# EAGLE design Mirror Image Board (EAGLE 9.2.0)
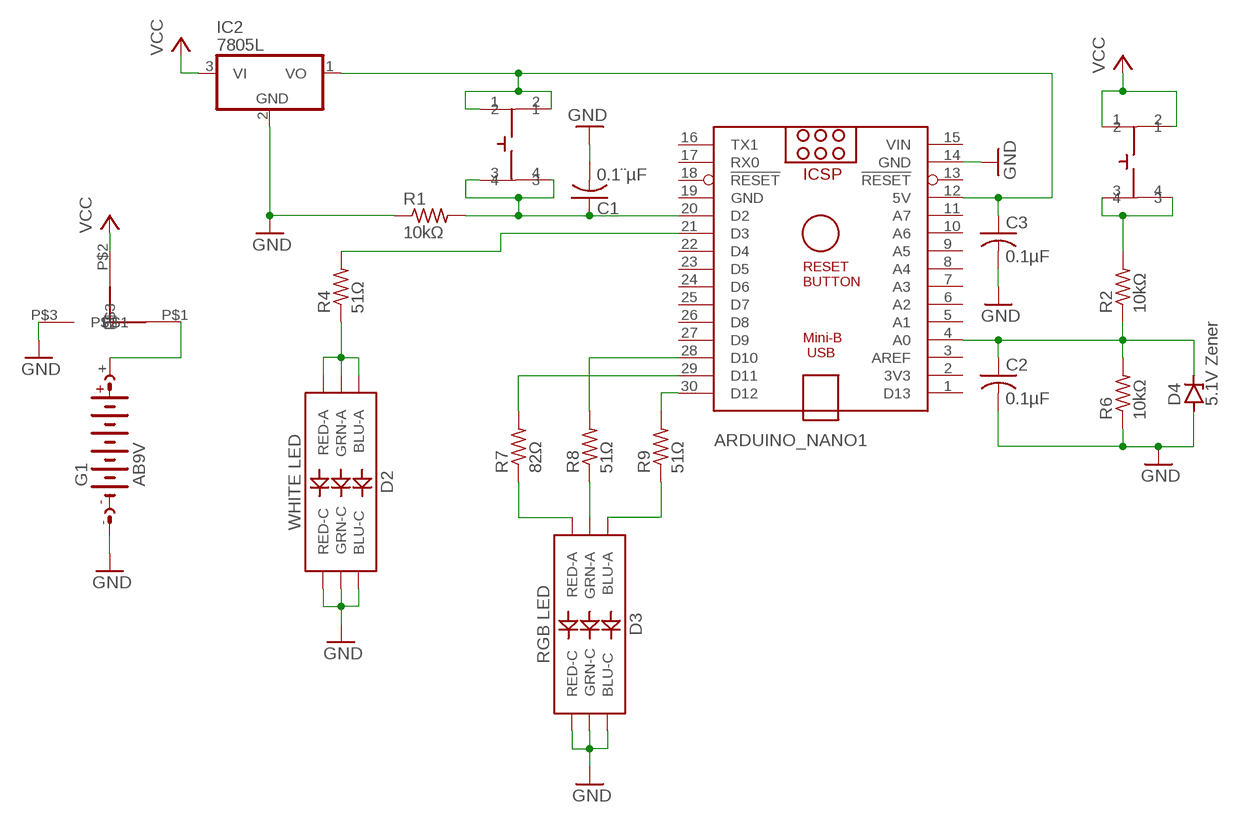
[diagram p0: schematic, sheet 1]

## Parts
ARDUINO_NANO1  ARDUINO_NANO  [ARDUINO_NANO]
C1  0.1¨µF  C-USC0805  [C0805]
C2  0.1µF  C-USC0805  [C0805]
C3  0.1µF  C-USC0805  [C0805]
D2  WHITE LED  LED-RGBNO_IC  [LED-TRICOLOR-5050]
D3  RGB LED  LED-RGBNO_IC  [LED-TRICOLOR-5050]
D4  5.1V Zener  ZENER-DIODESOD64-12  [SOD64Z12]
G1  AB9V  [AB9V]
IC2  7805L  [TO92]
R1  10kΩ  R-US_R0805  [R0805]
R2  10kΩ  R-US_R0805  [R0805]
R4  51Ω  R-US_R0805  [R0805]
R6  10kΩ  R-US_R0805  [R0805]
R7  82Ω  R-US_R0805  [R0805]
R8  51Ω  R-US_R0805  [R0805]
R9  51Ω  R-US_R0805  [R0805]
U$1  SKRPABE010  [SKRPABE010]
U$2  SKRPABE010  [SKRPABE010]
U$3  DIPSWITCH  [DIPSWITCH]

## Nets
GND: ARDUINO_NANO1.14(GND) C1.2 C2.2 C3.2 D2.4(BLU-C) D2.5(RED-C) D2.6(GRN-C) D3.4(BLU-C) D3.5(RED-C) D3.6(GRN-C) D4.A G1.- IC2.2(GND) R1.1 R6.1 U$3.P$3
N$1: G1.+ U$3.P$1
N$2: ARDUINO_NANO1.30(D12) R9.2
N$3: ARDUINO_NANO1.20(D2) C1.1 R1.2 U$1.3 U$1.4
N$4: ARDUINO_NANO1.12(5V) C3.1 IC2.1(VO) U$1.1 U$1.2
N$5: ARDUINO_NANO1.4(A0) C2.1 D4.C R2.1 R6.2
N$6: R2.2 U$2.3 U$2.4
N$7: ARDUINO_NANO1.21(D3) R4.2
N$8: ARDUINO_NANO1.29(D11) R7.2
N$9: D3.2(RED-A) R7.1
N$10: D3.1(GRN-A) R8.1
N$11: D3.3(BLU-A) R9.1
N$12: ARDUINO_NANO1.28(D10) R8.2
N$18: D2.1(GRN-A) D2.2(RED-A) D2.3(BLU-A) R4.1
VCC: IC2.3(VI) U$2.1 U$2.2 U$3.P$2
Unconnected: ARDUINO_NANO1.1(D13) ARDUINO_NANO1.2(3V3) ARDUINO_NANO1.3(AREF) ARDUINO_NANO1.5(A1) ARDUINO_NANO1.6(A2) ARDUINO_NANO1.7(A3) ARDUINO_NANO1.8(A4) ARDUINO_NANO1.9(A5) ARDUINO_NANO1.10(A6) ARDUINO_NANO1.11(A7) ARDUINO_NANO1.13(!RESET) ARDUINO_NANO1.16(TX1) ARDUINO_NANO1.17(RX0) ARDUINO_NANO1.18(!RESET) ARDUINO_NANO1.22(D4) ARDUINO_NANO1.23(D5) ARDUINO_NANO1.24(D6) ARDUINO_NANO1.25(D7) ARDUINO_NANO1.26(D8) ARDUINO_NANO1.27(D9)

## Power pins joined to a net without a drawn wire
GND: ARDUINO_NANO1.19(GND)
VIN: ARDUINO_NANO1.15(VIN)

## Library data of the parts
ARDUINO_NANO1 = ArduinoNanoV30:ARDUINO_NANO: Arduino Nano V3.0 Overview: The Arduino Nano is a small, complete, and breadboard-friendly board based on the ATmega328 (Arduino Nano 3.x) or ATmega168 (Arduino Nano 2.x). It has more or less the same functionality of the Arduino Duemilanove, but in a different package. It lacks only a DC power jack, and works with a Mini-B USB cable instead of a standard one. The Nano was designed and is being produced by Gravitech. Specifications: Microcontroller Atmel ATmega168 or ATmega328 Operating Voltage (logic level) 5 V Input Voltage (recommended) 7-12 V Input Voltage (limits) 6-20 V Digital I/O Pins 14 (of which 6 provide PWM output) Analog Input Pins 8 DC Current per I/O Pin 40 mA Flash Memory 16 KB (ATmega168) or 32 KB (ATmega328) of which 2 KB used by bootloader SRAM 1 KB (ATmega168) or 2 KB (ATmega328) EEPROM 512 bytes (ATmega168) or 1 KB (ATmega328) Clock Speed 16 MHz Dimensions 0.73" x 1.70" Length 45 mm Width 18 mm Weigth 5 g Power: The Arduino Nano can be powered via the Mini-B USB connection, 6-20V unregulated external power supply (pin 30), or 5V regulated external power supply (pin 27). The power source is automatically selected to the highest voltage source. Memory: The ATmega168 has 16 KB of flash memory for storing code (of which 2 KB is used for the bootloader); the ATmega328 has 32 KB, (also with 2 KB used for the bootloader). The ATmega168 has 1 KB of SRAM and 512 bytes of EEPROM (which can be read and written with the EEPROM library); the ATmega328 has 2 KB of SRAM and 1 KB of EEPROM. Input and Output: Each of the 14 digital pins on the Nano can be used as an input or output, using pinMode(), digitalWrite(), and digitalRead() functions. They operate at 5 volts. Each pin can provide or receive a maximum of 40 mA and has an internal pull-up resistor (disconnected by default) of 20-50 kOhms. In addition, some pins have specialized functions. Visit Arduino - ArduinoBoardNano <https://www.arduino.cc/en/Main/ArduinoBoardNano>
C1-C3 = adafruit:C-US: CAPACITOR, American symbol
D2 D3 = SparkFun-LED:LED-RGB: LED-RGB 6 pin RGB LED (no common connector) Packages: PLCC-6 LED-TRICOLOR-5050 - No built-in IC SparkFun Products: Digital Sandbox <https://www.sparkfun.com/products/12651> LED- SMD RGB <https://www.sparkfun.com/products/10866>; PROD_ID: DIO-10298
D4 = diode:ZENER-DIODE: Z-Diode
G1 = battery:AB9V: 9-V BATTERY CLIP
IC2 = adafruit:78*: Positive VOLTAGE REGULATOR Added bigger pads to the TO-92 package
R1 R2 R4 R6-R9 = adafruit:R-US_: RESISTOR, American symbol
U$1 U$2 = Custom Library:SKRPABE010
U$3 = Custom Library:DIPSWITCH

## Net classes
0 default: width 0.508 mm, drill 0.508 mm, clearance 0.305 mm

## Board
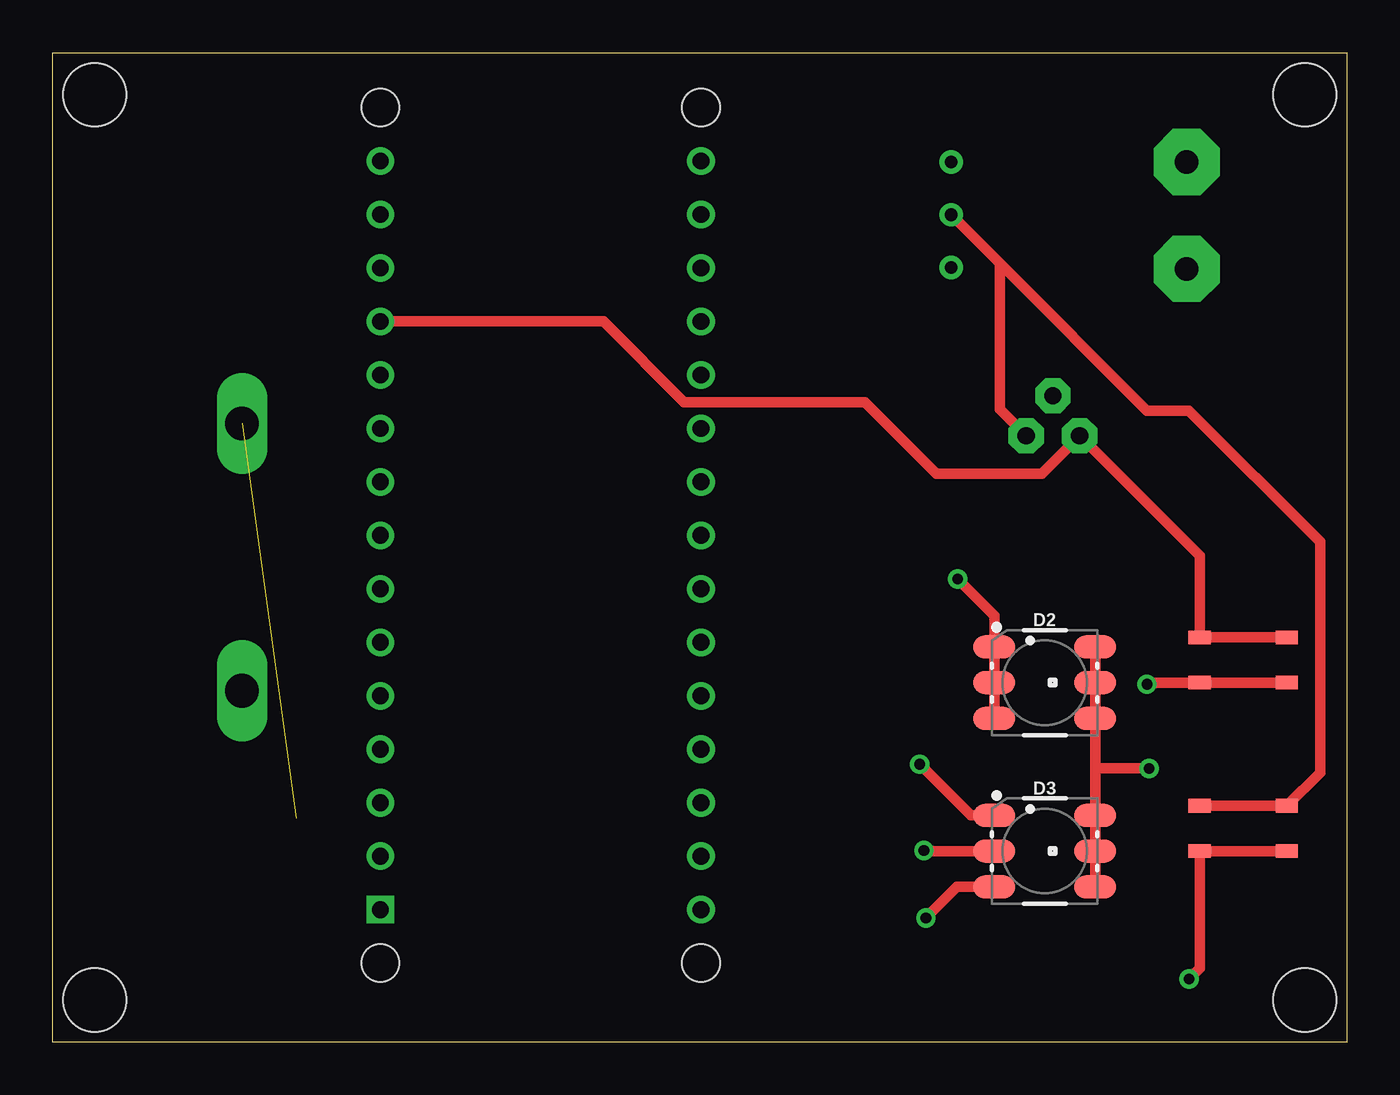
[diagram p1: board, top side]
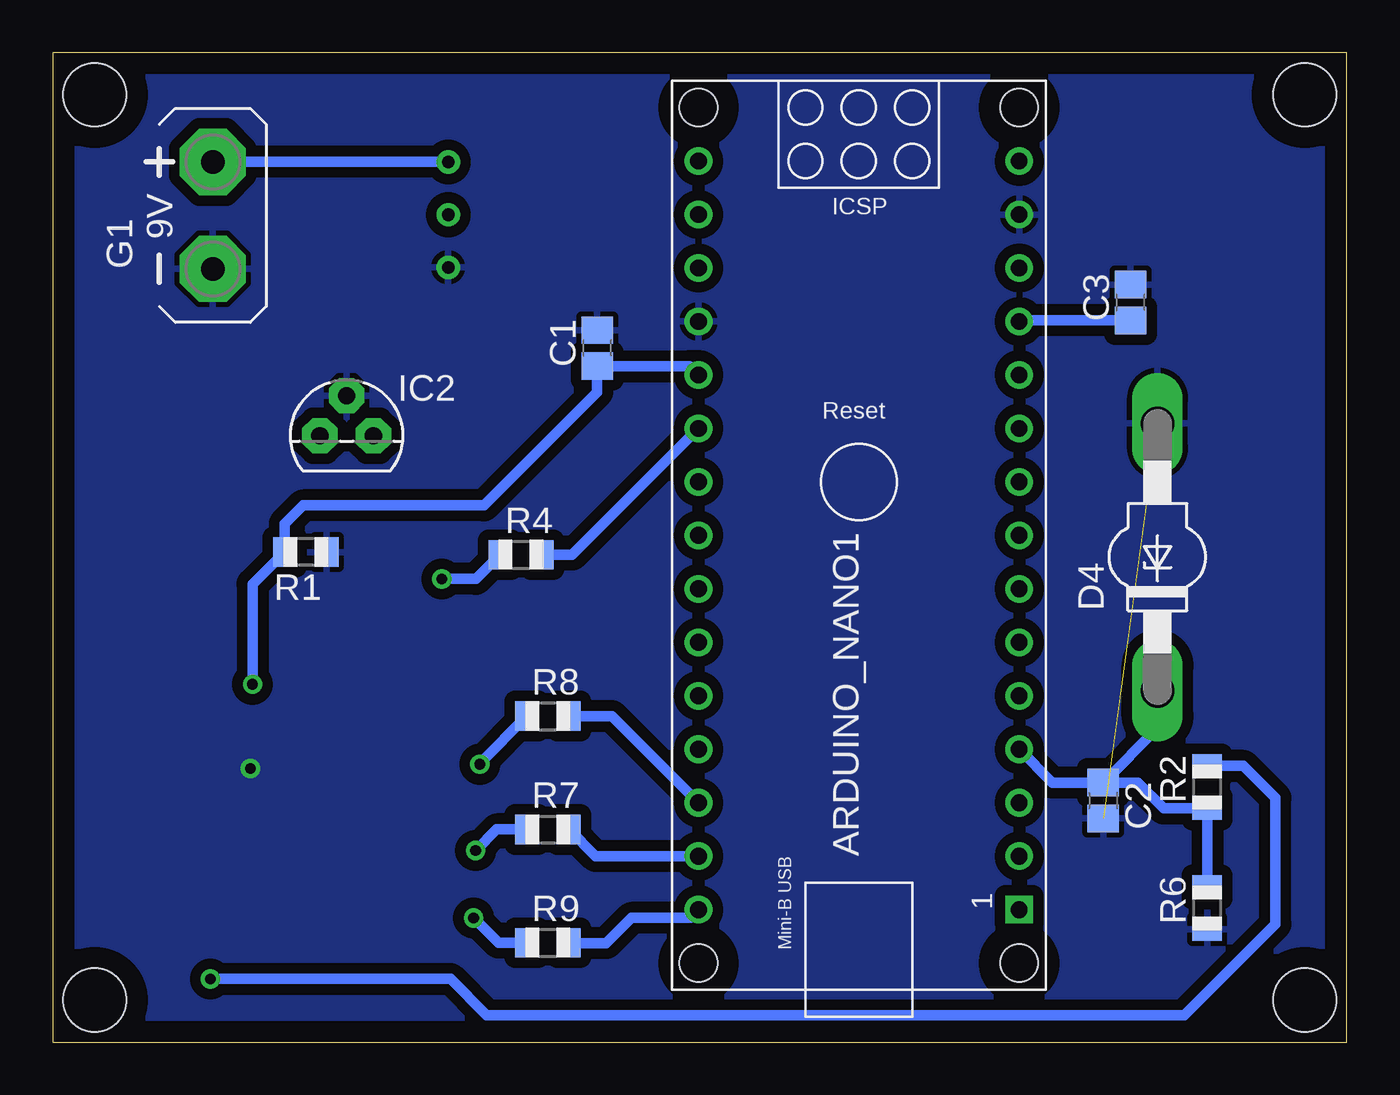
[diagram p2: board, bottom side, seen from below]

Size 61.5 x 47 mm. Coordinates in mm from the lower left corner, seen from the top.
Outline: 61.5,0 0,0 0,47 61.5,47 61.5,0
Copper layers (1*16): Top 0.035mm / dielectric 1.5mm / Bottom 0.035mm
Design rules "default *": minimum track width 6mil, minimum drill 0.35mm, track to track 20mil, track to pad 20mil, pad to pad 20mil, via to via 20mil, smd to smd 20mil, copper to edge 40mil, drill to drill 6mil, minimum pad ring 10mil, minimum via ring 8mil, stop-mask expansion 4mil, vias tented up to drill 0mil, thermal gap 10mil
Holes 3 mm at 59.5,45 59.5,2 2,2 2,45

### Footprints (pad centres in the part's own frame; a part is rotated, then mirrored left to right if it is on the bottom)
ARDUINO_NANO = drill 0.8 square: 1 -20.32,-7.62 | drill 0.8: 2 -17.78,-7.62; 3 -15.24,-7.62; 4 -12.7,-7.62; 5 -10.16,-7.62; 6 -7.62,-7.62; 7 -5.08,-7.62; 8 -2.54,-7.62; 9 0,-7.62; 10 2.54,-7.62; 11 5.08,-7.62; 12 7.62,-7.62; 13 10.16,-7.62; 14 12.7,-7.62; 15 15.24,-7.62; 16 15.24,7.62; 17 12.7,7.62; 18 10.16,7.62; 19 7.62,7.62; 20 5.08,7.62; 21 2.54,7.62; 22 0,7.62; 23 -2.54,7.62; 24 -5.08,7.62; 25 -7.62,7.62; 26 -10.16,7.62; 27 -12.7,7.62; 28 -15.24,7.62; 29 -17.78,7.62; 30 -20.32,7.62 | hole 1.778: -22.86,-7.62; -22.86,7.62; 17.78,7.62; 17.78,-7.62
C0805 = smd 1.3 x 1.5: 1 -0.85,0; 2 0.85,0
LED-TRICOLOR-5050 = smd 2 x 1.1: 1 -2.4,1.7; 2 -2.4,0; 3 -2.4,-1.7; 4 2.4,-1.7; 5 2.4,0; 6 2.4,1.7
SOD64Z12 = drill 1.6 long: A 6.35,0; C -6.35,0
AB9V = drill 1.118 pad 3.15 octagon: + 0,2.54; - 0,-2.54
TO92 = drill 0.813 pad 1.676 octagon: 1 -1.27,0; 2 0,1.905; 3 1.27,0
R0805 = smd 1.1 x 1.4: 1 -1,0; 2 1,0
SKRPABE010 = smd 1.05 x 0.65: 1 0,2.15; 2 4.15,2.15; 3 0,0; 4 4.15,0
DIPSWITCH = drill 0.6: P$1 0,0; P$2 0,2.5; P$3 0,5

### Placement (x,y rotation side)
ARDUINO_NANO1  23.19,26.61 90 bottom
C1  35.62,32.96 90 bottom
C2  11.58,11.48 270 bottom
C3  10.28,35.13 90 bottom
D2  47.14,17.07 0 top
D3  47.14,9.07 0 top
D4  9,23.04 90 bottom
G1  53.89,39.27 0 bottom
IC2  47.53,28.8 0 bottom
R1  49.47,23.28 180 bottom
R2  6.64,12.12 90 bottom
R4  39.24,23.15 0 bottom
R6  6.64,6.37 90 bottom
R7  37.97,10.1 0 bottom
R8  37.97,15.48 0 bottom
R9  37.97,4.72 0 bottom
U$1  54.5,17.07 0 top
U$2  54.5,9.07 0 top
U$3  42.7,41.8 180 bottom

### Tracks (layer width: path | path; a pad name or v marks a point on that pad's centre or on a via)
GND  (via drill 0.51)  (1 unrouted)
  Top 0.508: D2.6 D2.5 D2.4 49.54,13 | D3.4 D3.5 D3.6 49.54,13 | 49.54,13 v52.1,13
  pour Bottom: 62,48 62,-1 -7,-1 -7,48
N$1
  Bottom 0.508: G1.+ U$3.P$1
N$2
  Bottom 0.508: ARDUINO_NANO1.30 31.19,5.91 31.7,5.91 31.71,5.9 34,5.9 35.2,4.7 36.95,4.7 R9.2
N$3  (via drill 0.51)
  Top 0.508: U$1.4 U$1.3 52.08,17.07 v52,17
  Bottom 0.508: v52,17 52,21.75 R1.2 50.47,24.63 49.6,25.5 41,25.5 35.62,30.88 C1.1 31.23,32.11 ARDUINO_NANO1.20
N$4
  Top 0.508: ARDUINO_NANO1.12 26.17,34.23 30,30.4 38.6,30.4 42,27 47,27 IC2.1 54.5,23.1 U$1.1 U$1.2
  Bottom 0.508: C3.1 15.52,34.28 ARDUINO_NANO1.12
N$5
  Bottom 0.508: R6.2 R2.1 6.66,11.1 8.7,11.1 9.93,12.33 C2.1 | D4.C 9,14.91 C2.1 | C2.1 13.99,12.33 ARDUINO_NANO1.4
N$6  (via drill 0.51)
  Top 0.508: U$2.4 U$2.3 54.5,3.5 v54,3
  Bottom 0.508: v54,3 42.6,3 40.87,1.27 7.73,1.27 3.4,5.6 3.4,11.6 4.92,13.12 R2.2
N$7
  Bottom 0.508: ARDUINO_NANO1.21 36.81,23.15 R4.2
N$8
  Bottom 0.508: ARDUINO_NANO1.29 35.7,8.83 R7.2
N$9  (via drill 0.51)
  Top 0.508: v41.4,9.1 41.43,9.07 D3.2
  Bottom 0.508: R7.1 40.4,10.1 v41.4,9.1
N$10  (via drill 0.51)
  Top 0.508: v41.2,13.2 43.62,10.78 D3.1
  Bottom 0.508: R8.1 41.2,13.25 v41.2,13.2
N$11  (via drill 0.51)
  Top 0.508: v41.5,5.9 42.98,7.38 D3.3
  Bottom 0.508: R9.1 40.32,4.72 v41.5,5.9
N$12
  Bottom 0.508: ARDUINO_NANO1.28 34.92,15.48 R8.2
N$18  (via drill 0.51)
  Top 0.508: v43,22 44.74,20.26 D2.1 D2.2 D2.3
  Bottom 0.508: R4.1 41.39,22 v43,22
VCC
  Top 0.508: U$3.P$2 45,37 | 45,37 52,30 54,30 60.23,23.77 60.23,12.8 U$2.2 U$2.1 | IC2.3 45,30.06 45,37